# Altium schematic sheet RLC_renonant.SchDoc
size A4
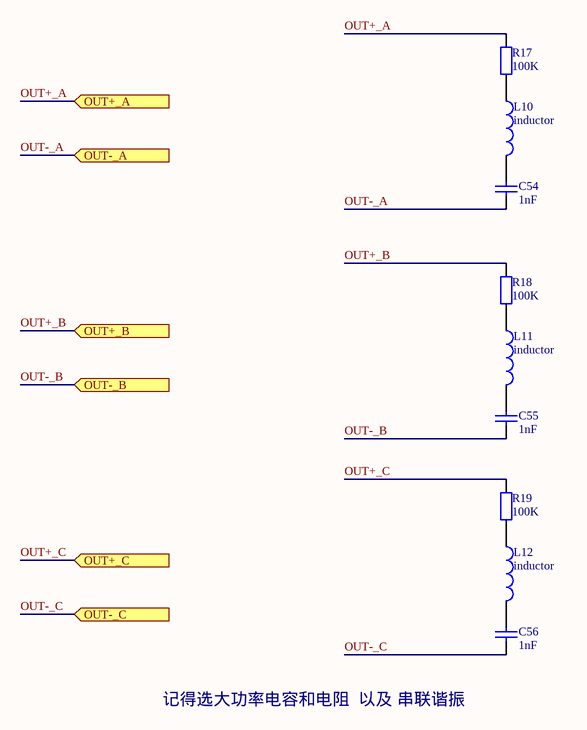
[diagram p0: RLC_renonant.SchDoc]

## Parts
C54  1nF  [RAD-0.2]
C55  1nF  [RAD-0.2]
C56  1nF  [RAD-0.2]
L10  inductor  [inductor]
L11  inductor  [inductor]
L12  inductor  [inductor]
R17  value 100K  [Res_big]  (hidden comment: Res)
R18  value 100K  [Res_big]  (hidden comment: Res)
R19  value 100K  [Res_big]  (hidden comment: Res)

## Ports
OUT+_A (in), OUT+_B (in), OUT+_C (in), OUT-_A (in), OUT-_B (in), OUT-_C (in)

## Nets
OUT+_A: R17.1 ; port OUT+_A
OUT+_B: R18.1 ; port OUT+_B
OUT+_C: R19.1 ; port OUT+_C
OUT-_A: C54.1 ; port OUT-_A
OUT-_B: C55.1 ; port OUT-_B
OUT-_C: C56.1 ; port OUT-_C
NetC54_2: C54.2 L10.2
NetC55_2: C55.2 L11.2
NetC56_2: C56.2 L12.2
NetL10_1: L10.1 R17.2
NetL11_1: L11.1 R18.2
NetL12_1: L12.1 R19.2

## Notes on the sheet
- 记得选大功率电容和电阻  以及 串联谐振

## Library data of the parts
C54-C56 = Cap
R17-R19 = Res: 原理图绘制者: 刘永钦; 原理图何处使用过: 2014年飞思卡尔底板; 原理图审核人1: 徐鹏飞; 封装0805何处使用过: 2015年航行器遥控器; 原理图审核人2: 朱觉文; 封装2512-RESC6332X06N何处使用过: 在无刷直流电机驱动板上使用过; 封装0603何处使用过: 在2401转接板上使用; 原理图提供者: 刘永钦; 封装0805绘制者: 刘永钦; 封装0805提供者: 刘永钦; 封装0805审核人1: 徐鹏飞; 封装0805审核人2: 朱觉文; 封装0603提供者: 刘永钦; 封装0603审核人2: 朱觉文; 封装0603审核人1: 徐鹏飞; 封装2512-RESC6332X06N审核人2: 朱觉文; 封装2512-RESC6332X06N提供者: 刘永钦; 封装2512-RESC6332X06N审核人1: 徐鹏飞; 封装0603绘制者: 刘永钦; 封装2512-RESC6332X06N绘制者: 刘永钦